# Altium project stm32f103c8t6.PrjPcb
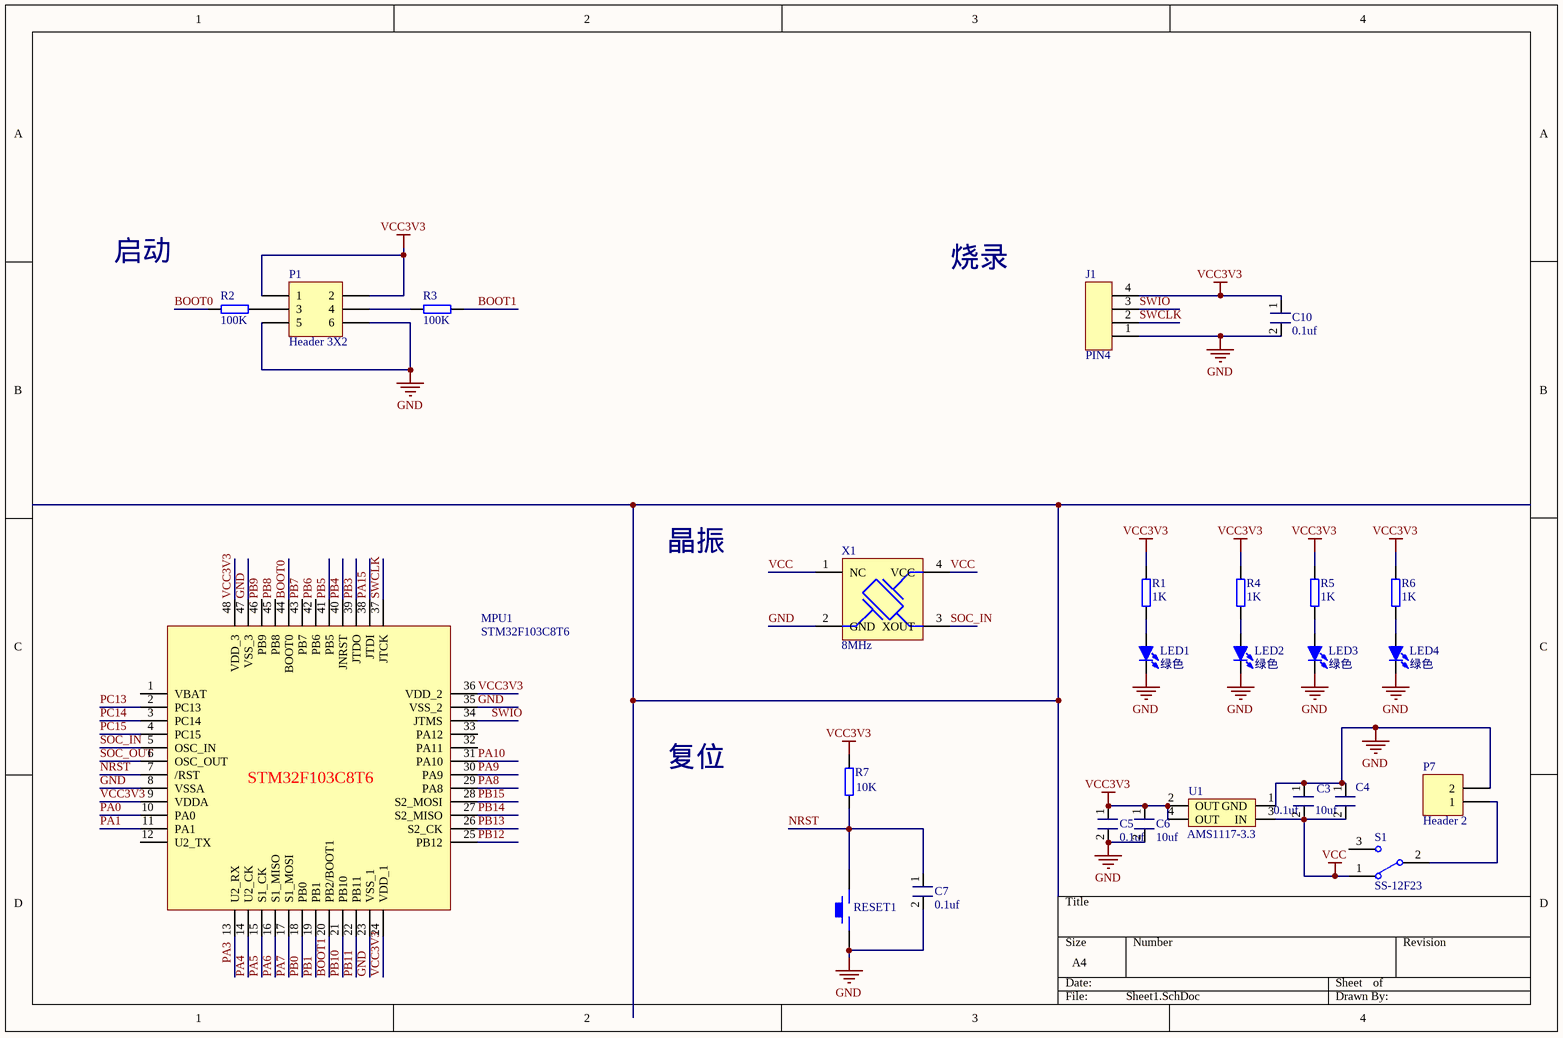
[diagram p0: Sheet1.SchDoc]
2 sheets, 45 parts. Net scope: global (net labels, ports and power ports of the same name join across sheets).
Board file: PCB1.PcbDoc
Sheets:
  Sheet1.SchDoc
  Sheet2.SchDoc

## Sheet Sheet1.SchDoc
size A4

### Parts
C3  0.1uf  [0603-C]
C4  10uf  [0603-C]
C5  0.1uf  [0603-C]
C6  10uf  [0603-C]
C7  0.1uf  [0603-C]
C10  0.1uf  [0603-C]
J1  PIN4  [HDR-1X4_H]
LED1  绿色  [LED 0603W]
LED2  绿色  [LED 0603W]
LED3  绿色  [LED 0603W]
LED4  绿色  [LED 0603W]
MPU1  STM32F103C8T6  [stm32f103c8t6]
P1  Header 3X2  [HDR2X3]
P7  Header 2  [TX60PW-F20]
R1  1K  [0603-R]
R2  100K  [0603-R]
R3  100K  [0603-R]
R4  1K  [0603-R]
R5  1K  [0603-R]
R6  1K  [0603-R]
R7  10K  [0603-R]
RESET1  KEY_M  [TSW SMD-6*6*11]  (value not drawn)
S1  SS-12F23  [SS-12D10]
U1  AMS1117-3.3  [AMS1117]
X1  8MHz

### Nets
GND: C3.1 C4.1 C5.2 C6.2 C7.2 C10.2 J1.1 LED1.2(K) LED2.2(K) LED3.2(K) LED4.2(K) MPU1.8(VSSA) MPU1.23(VSS_1) MPU1.35(VSS_2) MPU1.47(VSS_3) P1.5 P1.6 P7.2 RESET1.1 U1.1(GND) X1.2(GND)
VCC: C3.2 C4.2 S1.1 U1.3(IN) X1.1(NC) X1.4(VCC)
VCC3V3: C5.1 C6.1 C10.1 J1.4 MPU1.9(VDDA) MPU1.24(VDD_1) MPU1.36(VDD_2) MPU1.48(VDD_3) P1.1 P1.2 R1.1 R4.1 R5.1 R6.1 R7.2 U1.2(OUT) U1.4(OUT)
BOOT0: MPU1.44(BOOT0) R2.1
BOOT1: MPU1.20(PB2/BOOT1) R3.2
NRST: C7.1 MPU1.7(/RST) R7.1 RESET1.2
PA0: MPU1.10(PA0)
PA1: MPU1.11(PA1)
PA3: MPU1.13(U2_RX)
PA4: MPU1.14(U2_CK)
PA5: MPU1.15(S1_CK)
PA6: MPU1.16(S1_MISO)
PA7: MPU1.17(S1_MOSI)
PA8: MPU1.29(PA8)
PA9: MPU1.30(PA9)
PA10: MPU1.31(PA10)
PA15: MPU1.38(JTDI)
PB0: MPU1.18(PB0)
PB1: MPU1.19(PB1)
PB3: MPU1.39(JTDO)
PB4: MPU1.40(JNRST)
PB5: MPU1.41(PB5)
PB6: MPU1.42(PB6)
PB7: MPU1.43(PB7)
PB8: MPU1.45(PB8)
PB9: MPU1.46(PB9)
PB10: MPU1.21(PB10)
PB11: MPU1.22(PB11)
PB12: MPU1.25(PB12)
PB13: MPU1.26(S2_CK)
PB14: MPU1.27(S2_MISO)
PB15: MPU1.28(S2_MOSI)
PC13: MPU1.2(PC13)
PC14: MPU1.3(PC14)
PC15: MPU1.4(PC15)
SOC_IN: MPU1.5(OSC_IN) X1.3(XOUT)
SOC_OUT: MPU1.6(OSC_OUT)
SWCLK: J1.2 MPU1.37(JTCK)
SWIO: J1.3 MPU1.34(JTMS)
NetLED1_1: LED1.1(A) R1.2
NetLED2_1: LED2.1(A) R4.2
NetLED3_1: LED3.1(A) R5.2
NetLED4_1: LED4.1(A) R6.2
NetP1_3: P1.3 R2.2
NetP1_4: P1.4 R3.1
NetP7_1: P7.1 S1.2

Not connected (* = marked no-connect by the designer): MPU1 1(VBAT) 12(U2_TX) 32(PA11) 33(PA12); S1 3

### Notes on the sheet
- 启动
- 烧录
- 晶振
- 复位

### Library data of the parts
C3-C7 C10 = Cap
LED1-LED4 = LED-SMD: 贴片LED; 版权归属: 黎明电子style; BOM名称: 贴片LED; 学习资源: https://lmdzstyle.taobao.com/
P1 = Header 3X2: Header, 3-Pin, Dual row; LatestRevisionDate: 17-Jul-2002; LatestRevisionNote: Re-released for DXP Platform.; Publisher: Altium Limited
P7 = Header 2: Header, 2-Pin; LatestRevisionDate: 17-Jul-2002; LatestRevisionNote: Re-released for DXP Platform.; Publisher: Altium Limited
R1-R7 = RES-SMD
S1 = SSW-1P: 1路波动开关; BOM名称: 波动开关; 版权归属: 黎明电子style; 学习资源: https://lmdzstyle.taobao.com/
U1 = AMS1117
X1 = CRYSTAL-A

## Sheet Sheet2.SchDoc
size A4
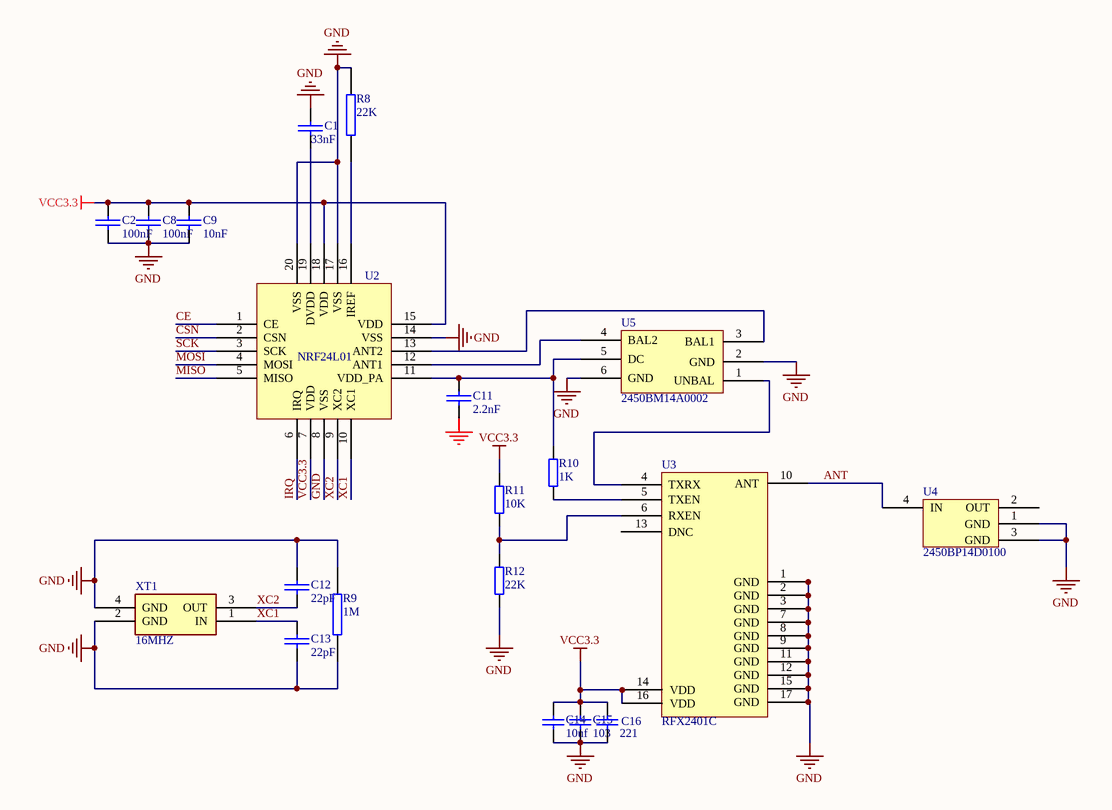
[diagram p1: Sheet2.SchDoc]

### Parts
C1  33nF  [0603]
C2  100nF  [0603]
C8  100nF  [0603]
C9  10nF  [0603]
C11  2.2nF  [0603]
C12  22pF  [0603]
C13  22pF  [0603]
C14  10uf
C15  103
C16  221
R8  22K  [0603]
R9  1M  [0603]
R10  1K
R11  10K
R12  22K
U2  NRF24L01  [nRF24l01]
U3  RFX2401C
U4  2450BP14D0100
U5  2450BM14A0002
XT1  16MHZ

### Nets
GND: C1.1 C2.2 C8.2 C9.2 C11.2 C12.2 C13.1 C14.2 C15.2 C16.2 R8.2 R9.1 R9.2 R12.1 U2.8(VSS) U2.14(VSS) U2.17(VSS) U2.20(VSS) U3.1(GND) U3.2(GND) U3.3(GND) U3.7(GND) U3.8(GND) U3.9(GND) U3.11(GND) U3.12(GND) U3.15(GND) U3.17(GND) U4.1(GND) U4.3(GND) U5.2(GND) U5.6(GND) XT1.2(GND) XT1.4(GND)
VCC3.3: C2.1 C8.1 C9.1 C14.1 C15.1 C16.1 R11.2 U2.7(VDD) U2.15(VDD) U2.18(VDD) U3.14(VDD) U3.16(VDD)
ANT: U3.10(ANT) U4.4(IN)
CE: U2.1(CE)
CSN: U2.2(CSN)
IRQ: U2.6(IRQ)
MISO: U2.5(MISO)
MOSI: U2.4(MOSI)
SCK: U2.3(SCK)
XC1: C13.2 U2.10(XC1) XT1.1(IN)
XC2: C12.1 U2.9(XC2) XT1.3(OUT)
NetC1_2: C1.2 U2.19(DVDD)
NetC11_1: C11.1 R10.2 U2.11(VDD_PA) U5.5(DC)
NetR8_1: R8.1 U2.16(IREF)
NetR10_1: R10.1 U3.5(TXEN)
NetR11_1: R11.1 R12.2 U3.6(RXEN)
NetU2_12: U2.12(ANT1) U5.4(BAL2)
NetU2_13: U2.13(ANT2) U5.3(BAL1)
NetU3_4: U3.4(TXRX) U5.1(UNBAL)

Not connected (* = marked no-connect by the designer): U3 13(DNC); U4 2(OUT)

### Library data of the parts
C1 C2 C8 C9 C11-C13 = CAP: Capacitor
C14-C16 = CAP-SMD
R8 R9 = RES2
R10-R12 = RES-SMD
XT1 = CRYSTAL-L

## Nets that join several sheets
GND: Sheet1 (21 pins), Sheet2 (34 pins)